# EAGLE schematic Blinker_02 (EAGLE 6.6.0)
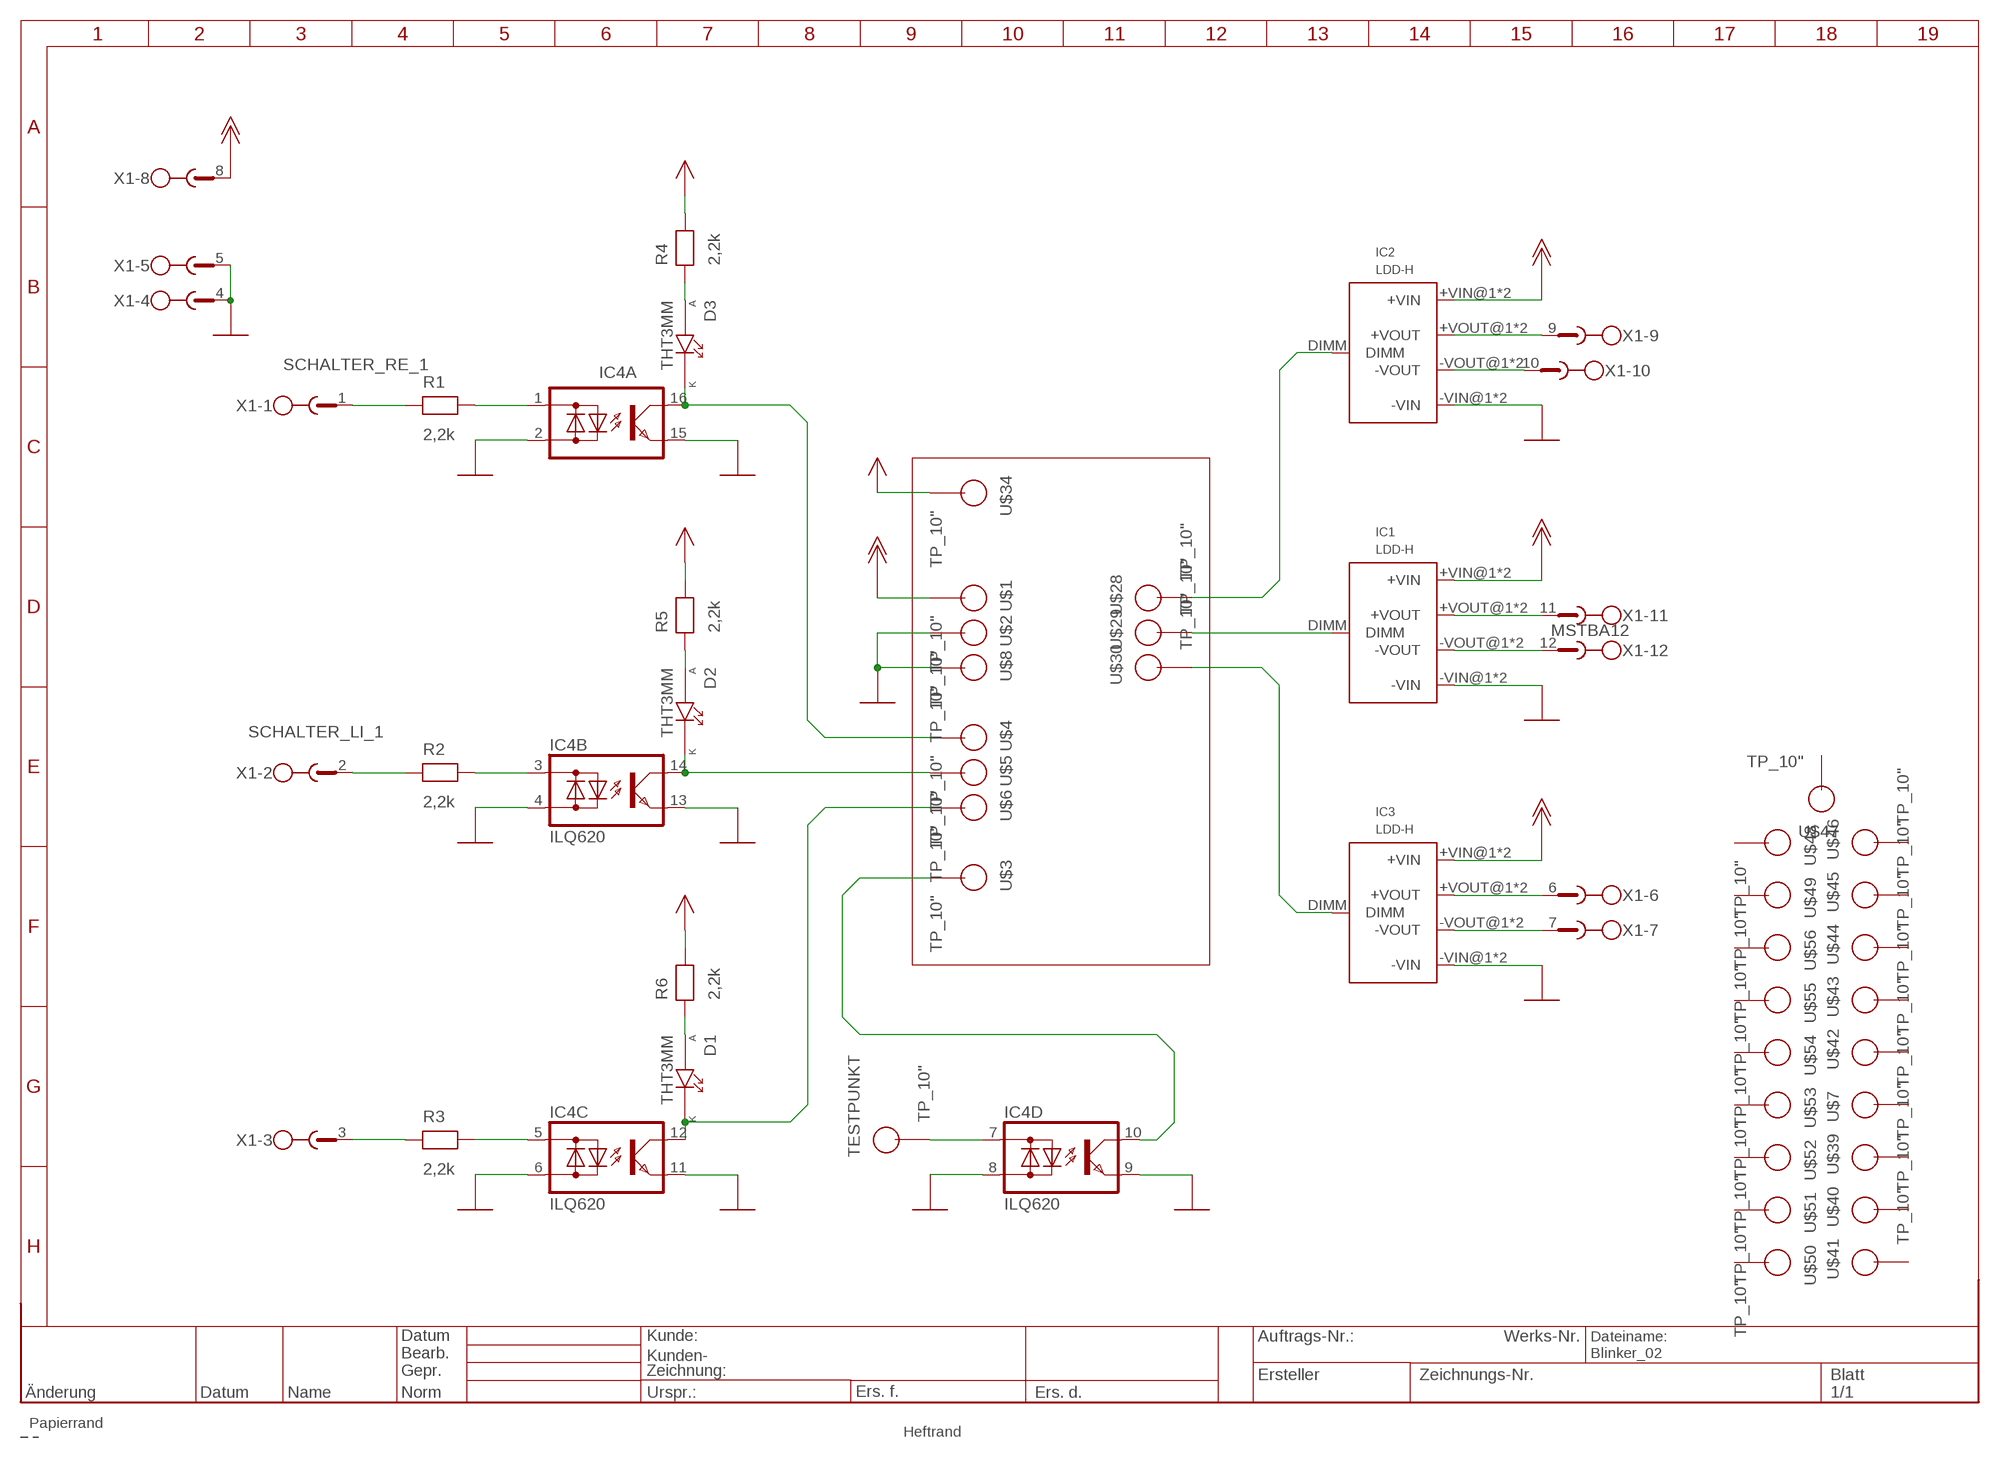
[diagram p0: schematic, sheet 1]

## Parts
D1  THT3MM  [THT3MM]
D2  THT3MM  [THT3MM]
D3  THT3MM  [THT3MM]
IC1  LDD-H  [LDD-H]
IC2  LDD-H  [LDD-H]
IC3  LDD-H  [LDD-H]
IC4  ILQ620  [DIL16]
R1  2,2k  RESEU-10  [R-10]
R2  2,2k  RESEU-10  [R-10]
R3  2,2k  RESEU-10  [R-10]
R4  2,2k  RESEU-10  [R-10]
R5  2,2k  RESEU-10  [R-10]
R6  2,2k  RESEU-10  [R-10]
TESTPUNKT  TP_10"  [TP_10]
U$1  TP_10"  [TP_10]
U$2  TP_10"  [TP_10]
U$3  TP_10"  [TP_10]
U$4  TP_10"  [TP_10]
U$5  TP_10"  [TP_10]
U$6  TP_10"  [TP_10]
U$7  TP_10"  [TP_10]
U$8  TP_10"  [TP_10]
U$28  TP_10"  [TP_10]
U$29  TP_10"  [TP_10]
U$30  TP_10"  [TP_10]
U$34  TP_10"  [TP_10]
U$39  TP_10"  [TP_10]
U$40  TP_10"  [TP_10]
U$41  TP_10"  [TP_10]
U$42  TP_10"  [TP_10]
U$43  TP_10"  [TP_10]
U$44  TP_10"  [TP_10]
U$45  TP_10"  [TP_10]
U$46  TP_10"  [TP_10]
U$47  TP_10"  [TP_10]
U$48  TP_10"  [TP_10]
U$49  TP_10"  [TP_10]
U$50  TP_10"  [TP_10]
U$51  TP_10"  [TP_10]
U$52  TP_10"  [TP_10]
U$53  TP_10"  [TP_10]
U$54  TP_10"  [TP_10]
U$55  TP_10"  [TP_10]
U$56  TP_10"  [TP_10]
X1  MSTBA12  [MSTBA12]

## Nets
+5V: R4.2 R5.2 R6.2 U$34.P$1(TP_13)
+12V: IC1.+VIN@1(+VIN) IC1.+VIN@2(+VIN) IC2.+VIN@1(+VIN) IC2.+VIN@2(+VIN) IC3.+VIN@1(+VIN) IC3.+VIN@2(+VIN) U$1.P$1(TP_13) X1.8
+VOUT_1: IC1.+VOUT@1(+VOUT) IC1.+VOUT@2(+VOUT) X1.11
+VOUT_2: IC2.+VOUT@1(+VOUT) IC2.+VOUT@2(+VOUT) X1.9
+VOUT_3: IC3.+VOUT@1(+VOUT) IC3.+VOUT@2(+VOUT) X1.6
-VOUT_1: IC1.-VOUT@1(-VOUT) IC1.-VOUT@2(-VOUT) X1.12
-VOUT_2: IC2.-VOUT@1(-VOUT) IC2.-VOUT@2(-VOUT) X1.10
-VOUT_3: IC3.-VOUT@1(-VOUT) IC3.-VOUT@2(-VOUT) X1.7
DIMMER_1: IC1.DIMM U$29.P$1(TP_13)
DIMMER_2: IC2.DIMM U$28.P$1(TP_13)
DIMMER_3: IC3.DIMM U$30.P$1(TP_13)
GND: IC1.-VIN@1(-VIN) IC1.-VIN@2(-VIN) IC2.-VIN@1(-VIN) IC2.-VIN@2(-VIN) IC3.-VIN@1(-VIN) IC3.-VIN@2(-VIN) IC4.2(A:AC2) IC4.4(B:AC2) IC4.6(C:AC2) IC4.8(D:AC2) IC4.9(D:E) IC4.11(C:E) IC4.13(B:E) IC4.15(A:E) U$2.P$1(TP_13) U$8.P$1(TP_13) X1.4 X1.5
LED_1: D1.A(P1A) R6.1
LED_2: D2.A(P1A) R5.1
LED_3: D3.A(P1A) R4.1
RESERVE_1: IC4.7(D:AC1) TESTPUNKT.P$1(TP_13)
RESERVE_2: IC4.10(D:C) U$3.P$1(TP_13)
SCH_LI_2: IC4.3(B:AC1) R2.2
SCH_LI_3: D2.K(P2K) IC4.14(B:C) U$5.P$1(TP_13)
SCH_RE_2: IC4.1(A:AC1) R1.2
SCH_RE_3: D3.K(P2K) IC4.16(A:C) U$4.P$1(TP_13)
SCH_RUE_2: IC4.5(C:AC1) R3.2
SCH_RUE_3: D1.K(P2K) IC4.12(C:C) U$6.P$1(TP_13)
SCHALTER_LI_1: R2.1 X1.2
SCHALTER_RE_1: R1.1 X1.1
SCHALTER_RUE_1: R3.1 X1.3
Unconnected: U$7.P$1(TP_13) U$39.P$1(TP_13) U$40.P$1(TP_13) U$41.P$1(TP_13) U$42.P$1(TP_13) U$43.P$1(TP_13) U$44.P$1(TP_13) U$45.P$1(TP_13) U$46.P$1(TP_13) U$47.P$1(TP_13) U$48.P$1(TP_13) U$49.P$1(TP_13) U$50.P$1(TP_13) U$51.P$1(TP_13) U$52.P$1(TP_13) U$53.P$1(TP_13) U$54.P$1(TP_13) U$55.P$1(TP_13) U$56.P$1(TP_13)

## Library data of the parts
D1-D3 = LED:THT3MM
IC1-IC3 = SPEZIAL:LDD-H
IC4 = optocoupler:ILQ620: SIEMENS OPTO COUPLER
R1-R6 = R-C:RESEU-10
TESTPUNKT U$1-U$8 U$28-U$30 U$34 U$39-U$56 = SUPPLY:TP_10
X1 = con-phoenix-508:MSTBA12: PHOENIX; MPN: 1757349; OC_FARNELL: 3705250; OC_NEWARK: 71C4169